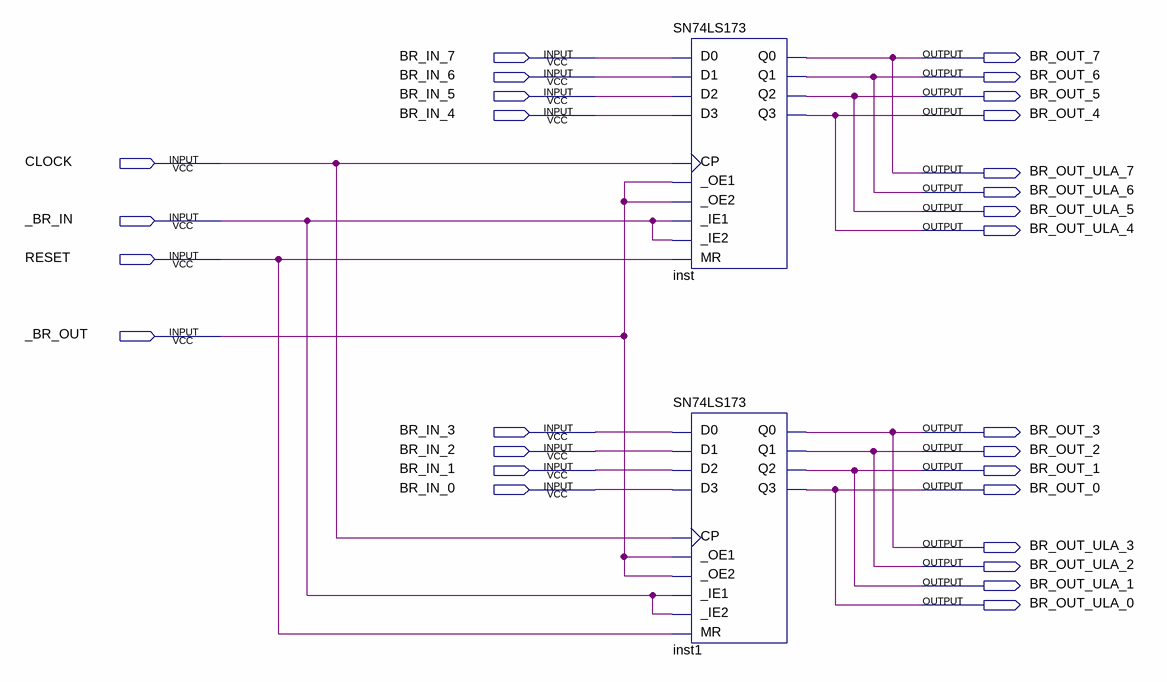
[diagram p0: schematic sheet]
// Quartus schematic BR.bdf as structural Verilog: 2 symbols, 28 pins
module BR (
  input  BR_IN_7,
  input  BR_IN_6,
  input  BR_IN_5,
  input  BR_IN_4,
  input  CLOCK,
  input  _BR_IN,
  input  RESET,
  input  _BR_OUT,
  input  BR_IN_3,
  input  BR_IN_2,
  input  BR_IN_1,
  input  BR_IN_0,
  output BR_OUT_7,
  output BR_OUT_6,
  output BR_OUT_5,
  output BR_OUT_4,
  output BR_OUT_ULA_7,
  output BR_OUT_ULA_6,
  output BR_OUT_ULA_5,
  output BR_OUT_ULA_4,
  output BR_OUT_3,
  output BR_OUT_2,
  output BR_OUT_1,
  output BR_OUT_0,
  output BR_OUT_ULA_3,
  output BR_OUT_ULA_2,
  output BR_OUT_ULA_1,
  output BR_OUT_ULA_0
);

  SN74LS173 inst (
    .D0(BR_IN_7), .D1(BR_IN_6), .D2(BR_IN_5), .D3(BR_IN_4), ._IE1(_BR_IN), ._IE2(_BR_IN), .CP(CLOCK),
    .MR(RESET), ._OE1(_BR_OUT), ._OE2(_BR_OUT), .Q0(BR_OUT_7), .Q1(BR_OUT_6), .Q2(BR_OUT_5), .Q3(BR_OUT_4));
  SN74LS173 inst1 (
    .D0(BR_IN_3), .D1(BR_IN_2), .D2(BR_IN_1), .D3(BR_IN_0), ._IE1(_BR_IN), ._IE2(_BR_IN), .CP(CLOCK),
    .MR(RESET), ._OE1(_BR_OUT), ._OE2(_BR_OUT), .Q0(BR_OUT_3), .Q1(BR_OUT_2), .Q2(BR_OUT_1), .Q3(BR_OUT_0));

  assign BR_OUT_ULA_0 = BR_OUT_0;
  assign BR_OUT_ULA_1 = BR_OUT_1;
  assign BR_OUT_ULA_2 = BR_OUT_2;
  assign BR_OUT_ULA_3 = BR_OUT_3;
  assign BR_OUT_ULA_4 = BR_OUT_4;
  assign BR_OUT_ULA_5 = BR_OUT_5;
  assign BR_OUT_ULA_6 = BR_OUT_6;
  assign BR_OUT_ULA_7 = BR_OUT_7;
endmodule
